# Altium schematic sheet LPCB234 - CORE INTERFACE.SchDoc
size A3; Address1: Factory 10; Address2: 9-13 Dingley Avenue, Dandeong, VICTORIA 3175, AUSTRALIA; DocumentNumber: 7; Revision: 1; SheetNumber: 7; SheetTotal: 10; Lockie__PCB_SUB_ASSEMBLY: RM48 Interface; Lockie__PCB_ASSEMBLY: Main; Lockie__LDL: LPCB234; Lockie__PCB_DESCRIPTION: RM4 Power Node
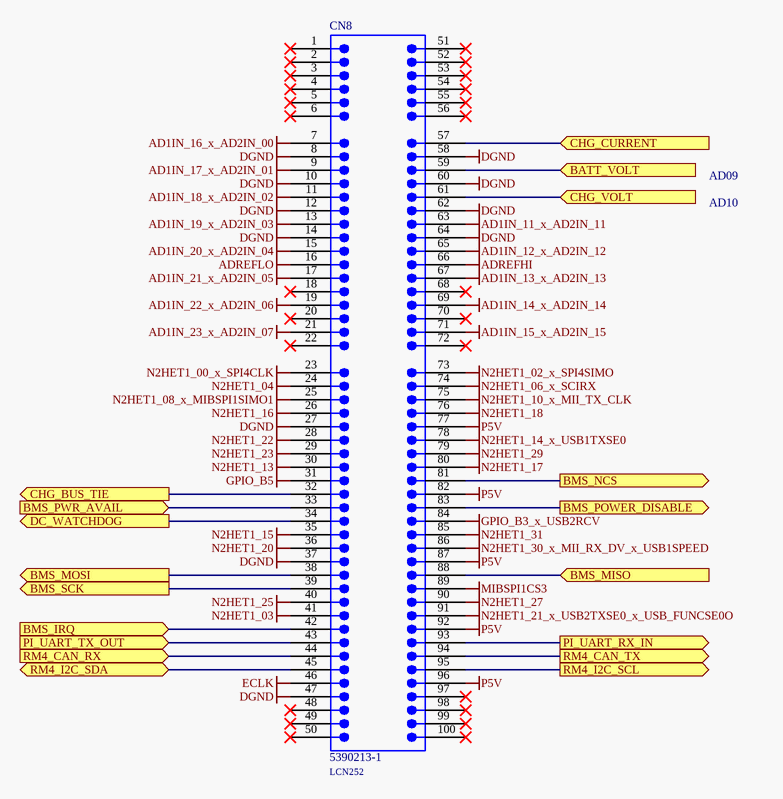
[diagram p0: LPCB234 - CORE INTERFACE.SchDoc]

## Parts
CN8  5390213-1  LDL_NUMBER: LCN252  [5390213-1]

## Ports
BATT_VOLT (in), BMS_IRQ (in), BMS_MISO (in), BMS_MOSI (out), BMS_NCS (out), BMS_POWER_DISABLE (out), BMS_PWR_AVAIL (in), BMS_SCK (out), CHG_BUS_TIE (out), CHG_CURRENT (in), CHG_VOLT (in), DC_WATCHDOG (out), PI_UART_RX_IN (out), PI_UART_TX_OUT (in), RM4_CAN_RX (in), RM4_CAN_TX (out), RM4_I2C_SCL (out), RM4_I2C_SDA (bidir)

## Nets
AD1IN_11_x_AD2IN_11: CN8.63
AD1IN_12_x_AD2IN_12: CN8.65
AD1IN_13_x_AD2IN_13: CN8.67
AD1IN_14_x_AD2IN_14: CN8.69
AD1IN_15_x_AD2IN_15: CN8.71
AD1IN_16_x_AD2IN_00: CN8.7
AD1IN_17_x_AD2IN_01: CN8.9
AD1IN_18_x_AD2IN_02: CN8.11
AD1IN_19_x_AD2IN_03: CN8.13
AD1IN_20_x_AD2IN_04: CN8.15
AD1IN_21_x_AD2IN_05: CN8.17
AD1IN_22_x_AD2IN_06: CN8.19
AD1IN_23_x_AD2IN_07: CN8.21
ADREFHI: CN8.66
ADREFLO: CN8.16
DGND: CN8.8 CN8.10 CN8.12 CN8.14 CN8.27 CN8.37 CN8.47 CN8.58 CN8.60 CN8.62 CN8.64
ECLK: CN8.46
GPIO_B3_x_USB2RCV: CN8.84
GPIO_B5: CN8.31
MIBSPI1CS3: CN8.89
N2HET1_00_x_SPI4CLK: CN8.23
N2HET1_02_x_SPI4SIMO: CN8.73
N2HET1_03: CN8.41
N2HET1_04: CN8.24
N2HET1_06_x_SCIRX: CN8.74
N2HET1_08_x_MIBSPI1SIMO1: CN8.25
N2HET1_10_x_MII_TX_CLK: CN8.75
N2HET1_13: CN8.30
N2HET1_14_x_USB1TXSE0: CN8.78
N2HET1_15: CN8.35
N2HET1_16: CN8.26
N2HET1_17: CN8.80
N2HET1_18: CN8.76
N2HET1_20: CN8.36
N2HET1_21_x_USB2TXSE0_x_USB_FUNCSE0O: CN8.91
N2HET1_22: CN8.28
N2HET1_23: CN8.29
N2HET1_25: CN8.40
N2HET1_27: CN8.90
N2HET1_29: CN8.79
N2HET1_30_x_MII_RX_DV_x_USB1SPEED: CN8.86
N2HET1_31: CN8.85
P5V: CN8.77 CN8.82 CN8.87 CN8.92 CN8.96
BATT_VOLT: CN8.59 ; port BATT_VOLT
BMS_IRQ: CN8.42 ; port BMS_IRQ
BMS_MISO: CN8.88 ; port BMS_MISO
BMS_MOSI: CN8.38 ; port BMS_MOSI
BMS_NCS: CN8.81 ; port BMS_NCS
BMS_POWER_DISABLE: CN8.83 ; port BMS_POWER_DISABLE
BMS_PWR_AVAIL: CN8.33 ; port BMS_PWR_AVAIL
BMS_SCK: CN8.39 ; port BMS_SCK
CHG_BUS_TIE: CN8.32 ; port CHG_BUS_TIE
CHG_CURRENT: CN8.57 ; port CHG_CURRENT
CHG_VOLT: CN8.61 ; port CHG_VOLT
DC_WATCHDOG: CN8.34 ; port DC_WATCHDOG
PI_UART_RX_IN: CN8.93 ; port PI_UART_RX_IN
PI_UART_TX_OUT: CN8.43 ; port PI_UART_TX_OUT
RM4_CAN_RX: CN8.44 ; port RM4_CAN_RX
RM4_CAN_TX: CN8.94 ; port RM4_CAN_TX
RM4_I2C_SCL: CN8.95 ; port RM4_I2C_SCL
RM4_I2C_SDA: CN8.45 ; port RM4_I2C_SDA

Not connected (* = marked no-connect by the designer): CN8 1* 2* 3* 4* 5* 6* 18* 20* 22* 48* 49* 50* 51* 52* 53* 54* 55* 56* 68* 70* 72* 97* 98* 99* 100*

## Notes on the sheet
- AD09
- AD10
- PCB COMPONENT DESCRIPTION
- LDL NUMBER
- Assembly Details
- Size
- Drawing File Name
- Revision
- http://rloop.org
- Scale
- A3
- Sheet Details
- N.T.S
- Sheet:
- Of:

## Library data of the parts
CN8 = 5390213-1: Connector, DIMM 100; FMEDA__FUNCTION_IN_SYSTEM: *